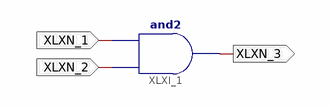
[diagram p0: schematic sheet 1]
// Xilinx ISE schematic glowny_schemat_reflekt.sch (aspartan6) as structural Verilog: 1 symbols, 3 ports
module glowny_schemat_reflekt (
  input  XLXN_1,
  input  XLXN_2,
  output XLXN_3
);

  and XLXI_1 (XLXN_3, XLXN_2, XLXN_1);
endmodule
